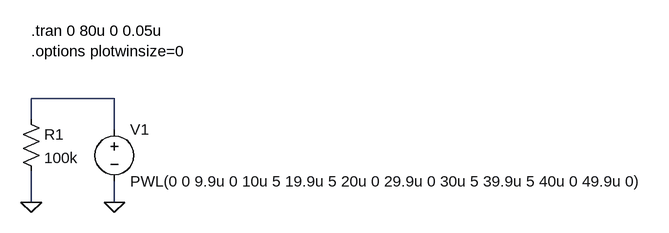
[diagram p0: schematic pwl.asc]
pwl.asc, the LTspice schematic file:
Version 4
SHEET 1 944 680
WIRE 32 32 -96 32
WIRE -96 64 -96 32
WIRE 32 80 32 32
WIRE -96 192 -96 144
WIRE 32 192 32 160
FLAG 32 192 0
FLAG -96 192 0
SYMBOL voltage 32 64 R0
SYMATTR InstName V1
SYMATTR Value PWL(0 0 9.9u 0 10u 5 19.9u 5 20u 0 29.9u 0 30u 5 39.9u 5 40u 0 49.9u 0)
SYMBOL res -112 48 R0
SYMATTR InstName R1
SYMATTR Value 100k
TEXT -96 -72 Left 0 !.tran 0 80u 0 0.05u\n.options plotwinsize=0

The netlist it stands for:
* pwl.asc
V1 N001 0 PWL(0 0 9.9u 0 10u 5 19.9u 5 20u 0 29.9u 0 30u 5 39.9u 5 40u 0 49.9u 0)
R1 N001 0 100k
.tran 0 80u 0 0.05u
.options plotwinsize=0
.backanno
.end